# EAGLE design P6_V5 (EAGLE 8.2.2)
COMPANY: ADAFRUIT INDUSTRIES; DRAWN: KTOWN; REV: B
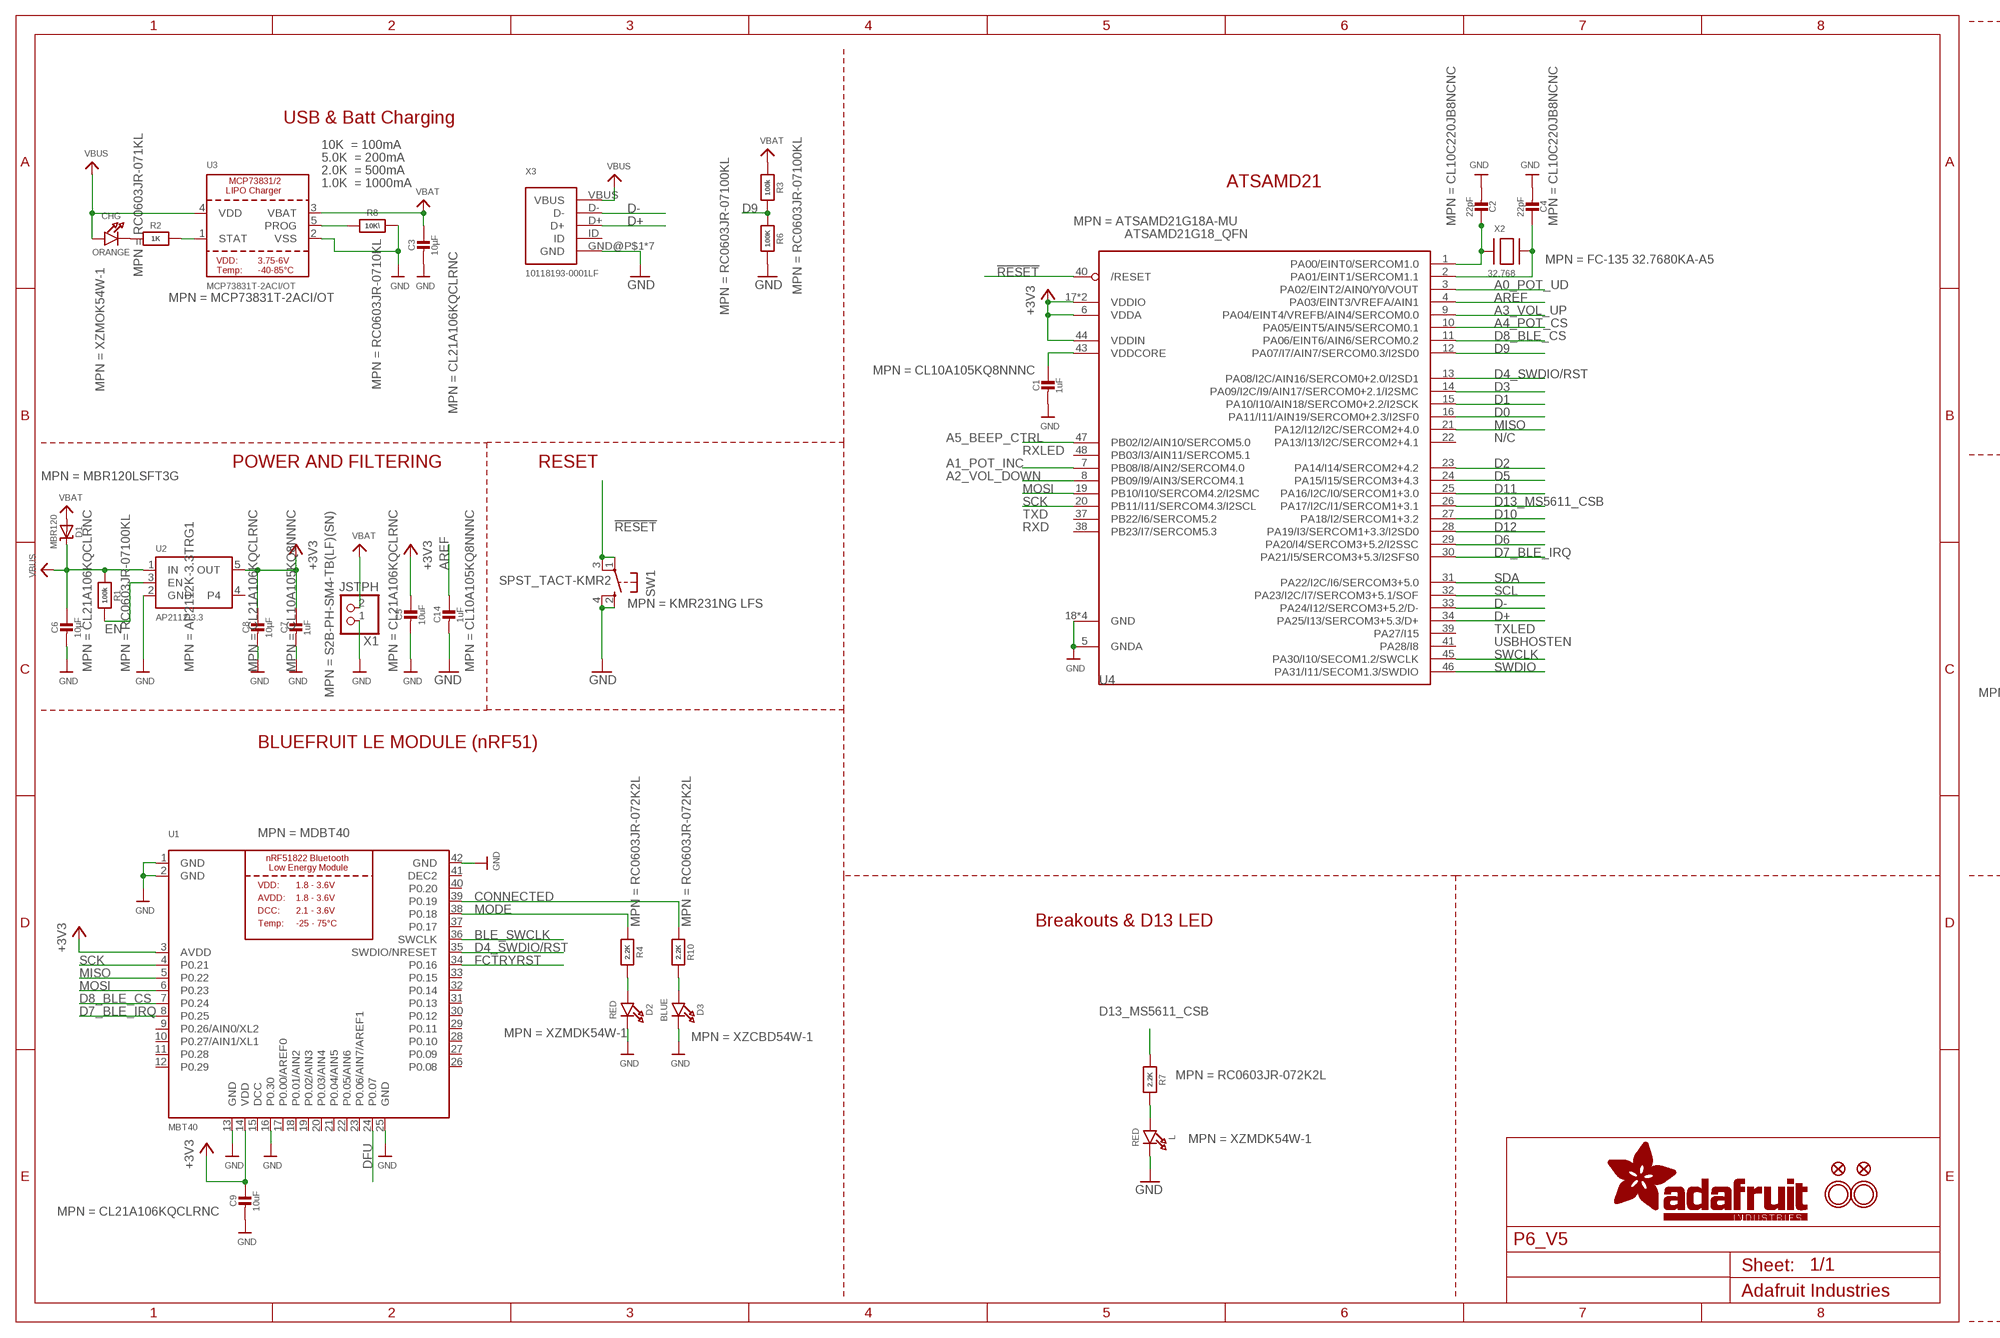
[diagram p0: schematic, sheet 1, part 1 of 2]
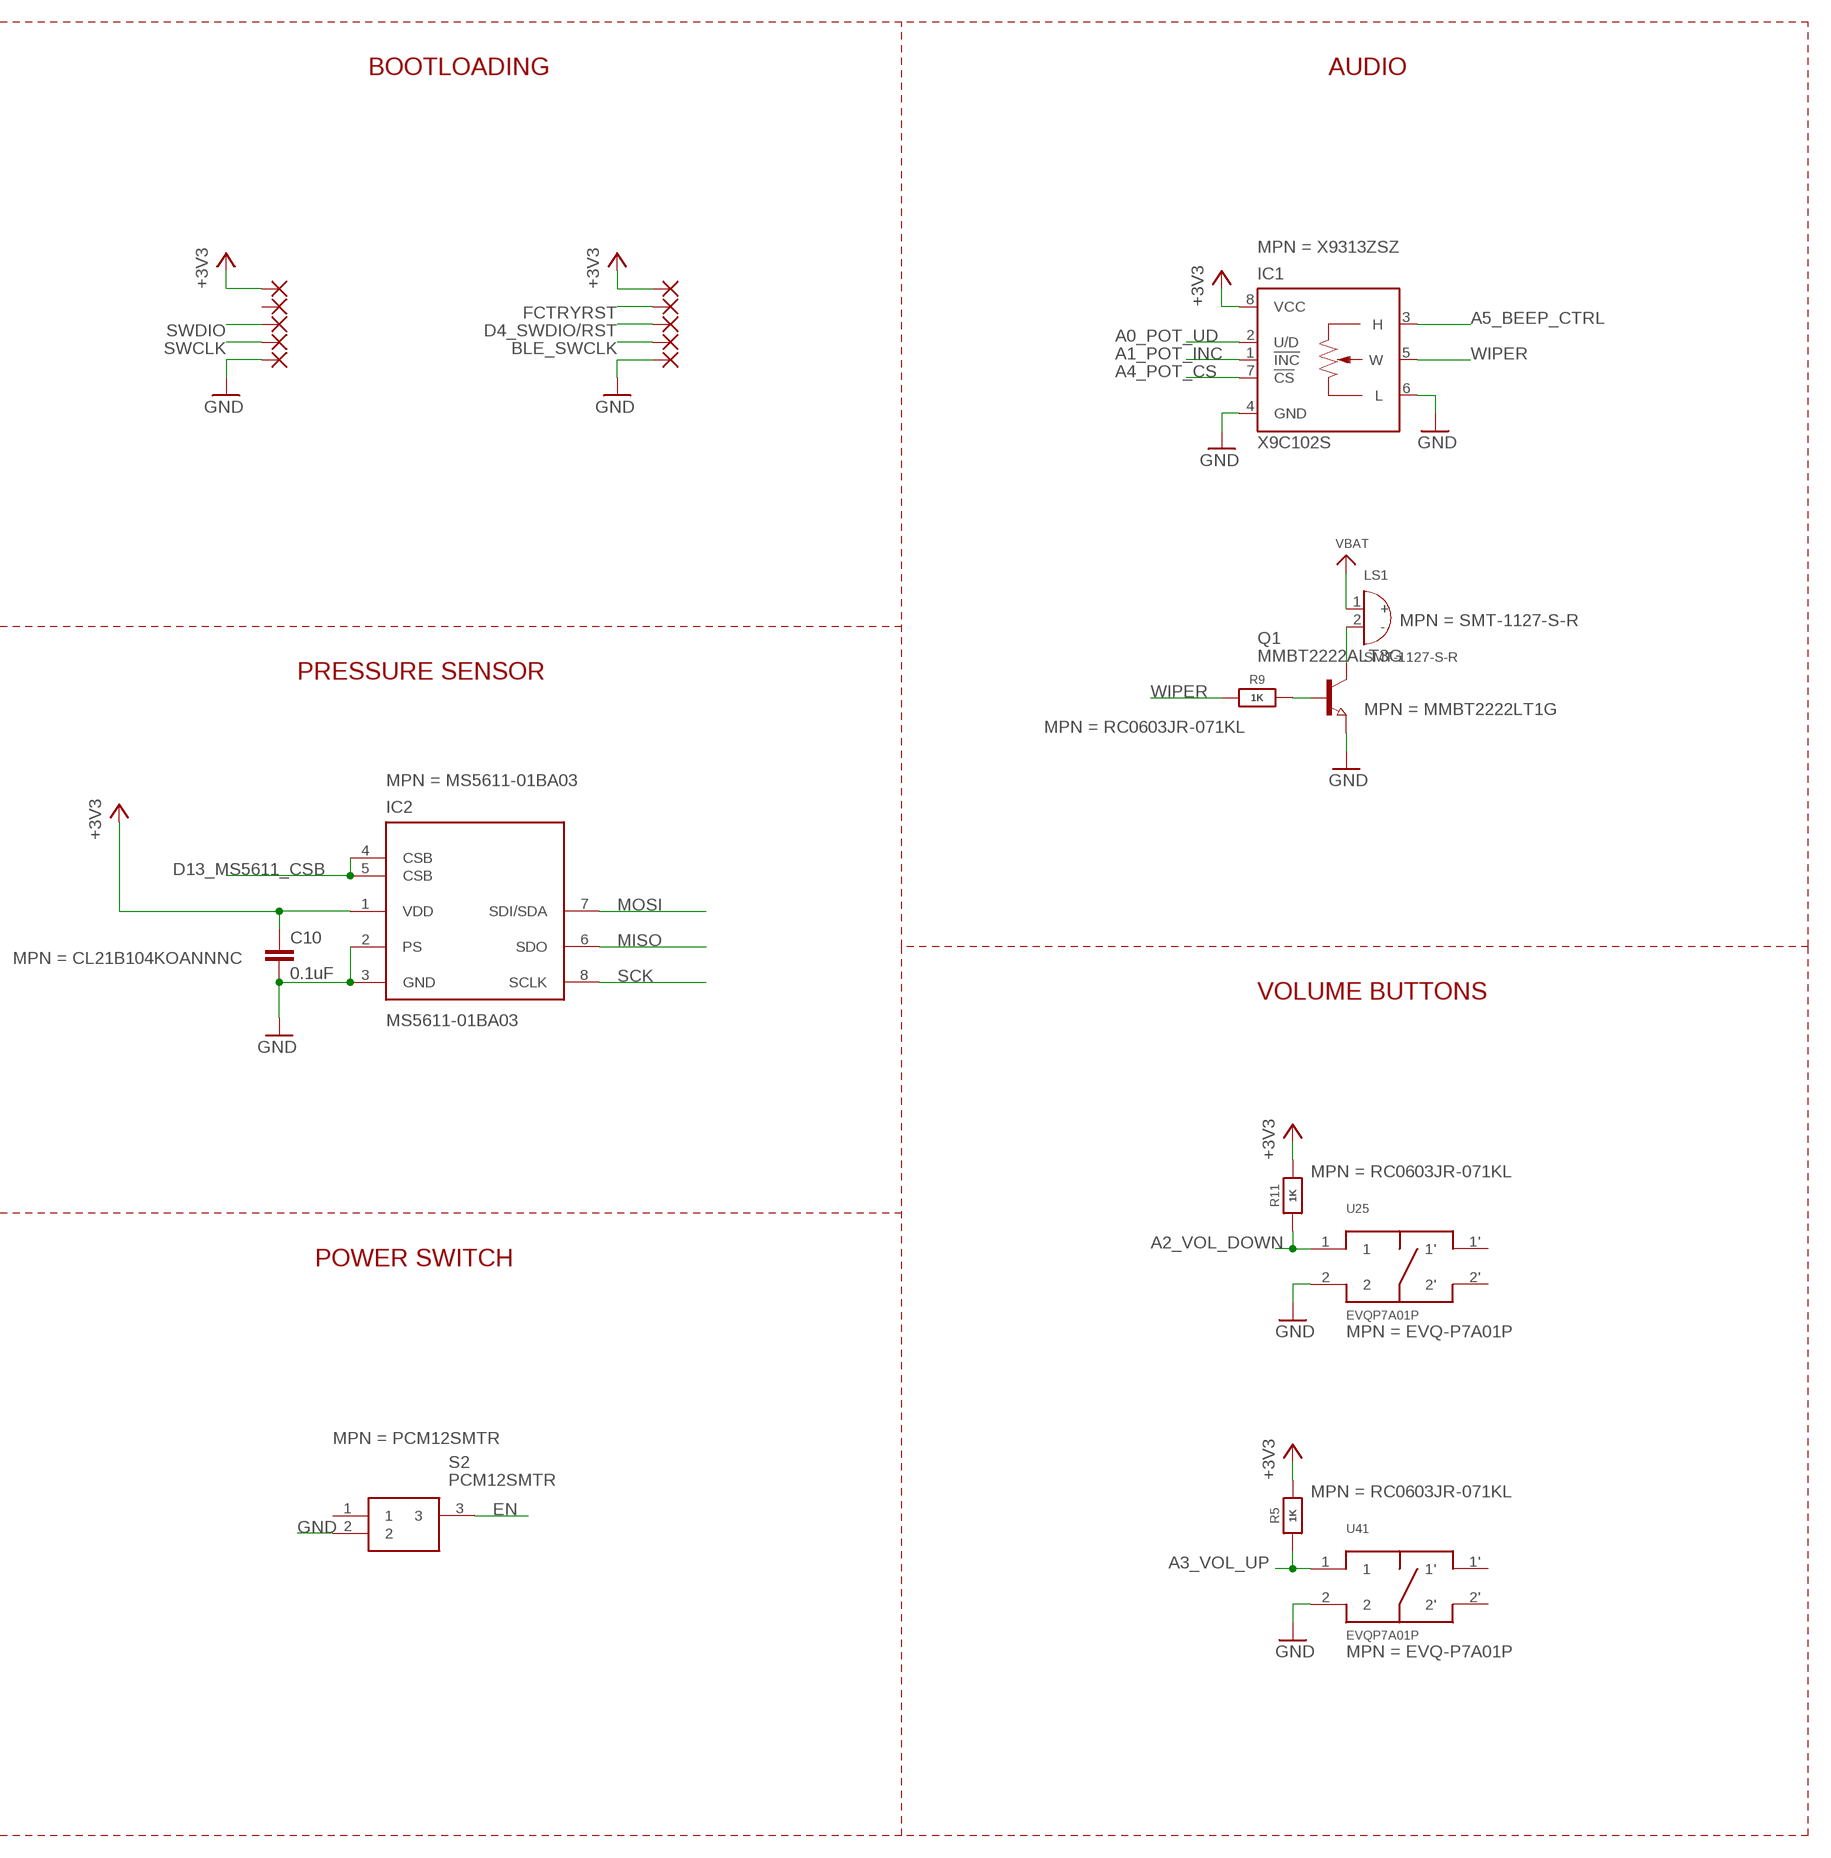
[diagram p1: schematic, sheet 1, part 2 of 2]

## Parts
C1  1uF  CAP_CERAMIC0603_NO  [0603-NO]
C2  22pF  CAP_CERAMIC0603_NO  [0603-NO]
C3  10µF  CAP_CERAMIC0805-NOOUTLINE  [0805-NO]
C4  22pF  CAP_CERAMIC0603_NO  [0603-NO]
C5  10uF  CAP_CERAMIC0805-NOOUTLINE  [0805-NO]
C6  10µF  CAP_CERAMIC0805-NOOUTLINE  [0805-NO]
C7  1uF  CAP_CERAMIC0603_NO  [0603-NO]
C8  10µF  CAP_CERAMIC0805-NOOUTLINE  [0805-NO]
C9  10uF  CAP_CERAMIC0805-NOOUTLINE  [0805-NO]
C10  0.1uF  C-EUC0805K  [C0805K]
C14  1uF  CAP_CERAMIC0603_NO  [0603-NO]
CHG  ORANGE  LED0805_NOOUTLINE  [CHIPLED_0805_NOOUTLINE]
D1  MBR120  DIODE-SCHOTTKYSOD-123  [SOD-123]
D2  RED  LED0805_NOOUTLINE  [CHIPLED_0805_NOOUTLINE]
D3  BLUE  LED0805_NOOUTLINE  [CHIPLED_0805_NOOUTLINE]
IC1  X9C102S  [SOIC08]
IC2  MS5611-01BA03  MS5611-01BA03UNO  [SON125P300X500X100-8N]
L  RED  LED0805_NOOUTLINE  [CHIPLED_0805_NOOUTLINE]
LS1  SMT-1127-S-R  [XDCR_SMT-1127-S-R]
PAD1  1,6/0,8  [1,6/0,8]
PAD2  1,6/0,8  [1,6/0,8]
PAD3  1,6/0,8  [1,6/0,8]
PAD4  1,6/0,8  [1,6/0,8]
PAD5  1,6/0,8  [1,6/0,8]
PAD6  1,6/0,8  [1,6/0,8]
PAD7  1,6/0,8  [1,6/0,8]
PAD8  1,6/0,8  [1,6/0,8]
PAD9  1,6/0,8  [1,6/0,8]
PAD10  1,6/0,8  [1,6/0,8]
Q1  MMBT2222ALT3G  NPN-TRANSISTOR_SOT23  [SOT23]
R1  100k  RESISTOR_0603_NOOUT  [0603-NO]
R2  1K  RESISTOR_0603_NOOUT  [0603-NO]
R3  100k  RESISTOR_0603_NOOUT  [0603-NO]
R4  2.2K  RESISTOR_0603_NOOUT  [0603-NO]
R5  1K  RESISTOR_0603_NOOUT  [0603-NO]
R6  100K  RESISTOR_0603_NOOUT  [0603-NO]
R7  2.2K  RESISTOR_0603_NOOUT  [0603-NO]
R8  10K\  RESISTOR_0603_NOOUT  [0603-NO]
R9  1K  RESISTOR_0603_NOOUT  [0603-NO]
R10  2.2K  RESISTOR_0603_NOOUT  [0603-NO]
R11  1K  RESISTOR_0603_NOOUT  [0603-NO]
S2  PCM12SMTR  [PCM12SMTR_1]
SW1  SPST_TACT-KMR2  [KMR2]
U1  MBT40  NRF51822_MODULE_MDBT40  [BLE_MODULE_RAYTAC_MDBT40]
U2  AP2112-3.3  VREG_SOT23-5  [SOT23-5]
U3  MCP73831T-2ACI/OT  MCP73831/2  [SOT23-5]
U4  ATSAMD21G18_QFN  ATSAMD21J_QFN  [TQFN48_7MM]
U25  EVQP7A01P  [EVQP7A01P]
U41  EVQP7A01P  [EVQP7A01P]
U$31  MOUNTINGHOLE2.5  [MOUNTINGHOLE_2.5_PLATED]
U$32  MOUNTINGHOLE2.5  [MOUNTINGHOLE_2.5_PLATED]
U$34  FIDUCIAL""  [FIDUCIAL_1MM]
U$35  FIDUCIAL""  [FIDUCIAL_1MM]
X1  JSTPH  CON_JST_PH_2PIN  [JSTPH2]
X2  32.768  XTAL-3.2X1.5  [XTAL3215]
X3  10118193-0001LF  [10118193-0001LF]

## Nets
!RESET: SW1.1(P) SW1.3(P1) U4.40(/RESET)
+3V3: C5.1 C7.1 C8.1 C9.1 C10.1 IC1.8(VCC) IC2.1(VDD) PAD2.1(P) PAD6.1(P) R5.2 R11.2 U1.3(AVDD) U1.14(VDD) U2.5(OUT) U4.6(VDDA) U4.17(VDDIO) U4.36(VDDIO) U4.44(VDDIN)
A0_POT_UD: IC1.2(U/D) U4.3(PA02/EINT2/AIN0/Y0/VOUT)
A1_POT_INC: IC1.1(!INC) U4.7(PB08/I8/AIN2/SERCOM4.0)
A2_VOL_DOWN: R11.1 U4.8(PB09/I9/AIN3/SERCOM4.1) U25.1
A3_VOL_UP: R5.1 U4.9(PA04/EINT4/VREFB/AIN4/SERCOM0.0) U41.1
A4_POT_CS: IC1.7(!CS) U4.10(PA05/EINT5/AIN5/SERCOM0.1)
A5_BEEP_CTRL: IC1.3(H) U4.47(PB02/I2/AIN10/SERCOM5.0)
AREF: C14.1 U4.4(PA03/EINT3/VREFA/AIN1)
BLE_SWCLK: PAD9.1(P) U1.36(SWCLK)
CONNECTED: R10.1 U1.39(P0.19)
D0: U4.16(PA11/I11/AIN19/SERCOM0+2.3/I2SF0)
D1: U4.15(PA10/I10/AIN18/SERCOM0+2.2/I2SCK)
D2: U4.23(PA14/I14/SERCOM2+4.2)
D3: U4.14(PA09/I2C/I9/AIN17/SERCOM0+2.1/I2SMC)
D4_SWDIO/RST: PAD8.1(P) U1.35(SWDIO/NRESET) U4.13(PA08/I2C/AIN16/SERCOM0+2.0/I2SD1)
D5: U4.24(PA15/I15/SERCOM3+4.3)
D6: U4.29(PA20/I4/SERCOM3+5.2/I2SSC)
D7_BLE_IRQ: U1.8(P0.25) U4.30(PA21/I5/SERCOM3+5.3/I2SFS0)
D8_BLE_CS: U1.7(P0.24) U4.11(PA06/EINT6/AIN6/SERCOM0.2)
D9: R3.2 R6.1 U4.12(PA07/I7/AIN7/SERCOM0.3/I2SD0)
D10: U4.27(PA18/I2/SERCOM1+3.2)
D11: U4.25(PA16/I2C/I0/SERCOM1+3.0)
D12: U4.28(PA19/I3/SERCOM1+3.3/I2SD0)
D13_MS5611_CSB: IC2.4(CSB) IC2.5(CSB) R7.1 U4.26(PA17/I2C/I1/SERCOM1+3.1)
D+: U4.34(PA25/I13/SERCOM3+5.3/D+) X3.D+
D-: U4.33(PA24/I12/SERCOM3+5.2/D-) X3.D-
DFU: U1.24(P0.07)
EN: R1.2 S2.3 U2.3(EN)
FCTRYRST: PAD7.1(P) U1.34(P0.16)
GND: C1.2 C2.2 C3.2 C4.2 C5.2 C6.2 C7.2 C8.2 C9.2 C10.2 C14.2 D2.C D3.C IC1.4(GND) IC1.6(L) IC2.2(PS) IC2.3(GND) L.C PAD5.1(P) PAD10.1(P) Q1.2(E) R6.2 R8.2 S2.2 SW1.2(S) SW1.4(S1) U1.1(GND) U1.2(GND) U1.13(GND) U1.16(P0.30) U1.25(GND) U1.42(GND) U2.2(GND) U3.2(VSS) U4.5(GNDA) U4.18(GND) U4.35(GND) U4.42(GND) U4.THERMAL(GND) U25.2 U41.2 X1.1 X3.GND@P$1(GND) X3.GND@P$2(GND) X3.GND@P$5(GND) X3.GND@P$6(GND) X3.GND@P$7(GND) X3.GND@P$8(GND) X3.GND@P$9(GND)
MISO: IC2.6(SDO) U1.5(P0.22) U4.21(PA12/I12/I2C/SERCOM2+4.0)
MODE: R4.1 U1.38(P0.18)
MOSI: IC2.7(SDI/SDA) U1.6(P0.23) U4.19(PB10/I10/SERCOM4.2/I2SMC)
N$1: CHG.C R2.1
N$2: L.A R7.2
N$3: R2.2 U3.1(STAT)
N$4: R8.1 U3.5(PROG)
N$5: C2.1 U4.1(PA00/EINT0/SERCOM1.0) X2.P$1
N$6: D2.A R4.2
N$7: C4.1 U4.2(PA01/EINT1/SERCOM1.1) X2.P$2
N$8: D3.A R10.2
N$9: Q1.1(B) R9.2
N$10: LS1.2(-) Q1.3(C)
SCK: IC2.8(SCLK) U1.4(P0.21) U4.20(PB11/I11/SERCOM4.3/I2SCL)
SCL: U4.32(PA23/I2C/I7/SERCOM3+5.1/SOF)
SDA: U4.31(PA22/I2C/I6/SERCOM3+5.0)
SWCLK: PAD4.1(P) U4.45(PA30/I10/SECOM1.2/SWCLK)
SWDIO: PAD3.1(P) U4.46(PA31/I11/SECOM1.3/SWDIO)
VBAT: C3.1 D1.A LS1.1(+) R3.1 U3.3(VBAT) X1.2
VBUS: C6.1 CHG.A D1.C R1.1 U2.1(IN) U3.4(VDD) X3.VBUS
VDDCORE: C1.1 U4.43(VDDCORE)
WIPER: IC1.5(W) R9.1
Unconnected: PAD1.1(P) S2.1 U1.9(P0.26/AIN0/XL2) U1.10(P0.27/AIN1/XL1) U1.11(P0.28) U1.12(P0.29) U1.17(P0.00/AREF0) U1.18(P0.01/AIN2) U1.19(P0.02/AIN3) U1.20(P0.03/AIN4) U1.21(P0.04/AIN5) U1.22(P0.05/AIN6) U1.23(P0.06/AIN7/AREF1) U1.26(P0.08) U1.27(P0.09) U1.28(P0.10) U1.29(P0.11) U1.30(P0.12) U1.31(P0.13) U1.32(P0.14) U1.33(P0.15) U1.37(P0.17) U1.40(P0.20) U2.4 U4.22(PA13/I13/I2C/SERCOM2+4.1) U4.37(PB22/I6/SERCOM5.2) U4.38(PB23/I7/SERCOM5.3) U4.39(PA27/I15) U4.41(PA28/I8) U4.48(PB03/I3/AIN11/SERCOM5.1) U25.1' U25.2' U41.1' U41.2' X3.ID

## Notes on the sheet
- BOOTLOADING | AUDIO
- USB & Batt Charging
- 10K  = 100mA
- 5.0K  = 200mA
- 2.0K  = 500mA
- 1.0K  = 1000mA | ATSAMD21
- N/C
- RXLED
- POWER AND FILTERING | RESET
- PRESSURE SENSOR
- TXD
- RXD
- TXLED
- USBHOSTEN
- VOLUME BUTTONS
- BLUEFRUIT LE MODULE (nRF51)
- POWER SWITCH
- Breakouts & D13 LED

## Power pins joined to a net without a drawn wire
DCC: U1.15(DCC)
DEC2: U1.41(DEC2)

## Library data of the parts
C1 C7 C14 = microbuilder:CAP_CERAMIC: Ceramic Capacitors For new designs, use the packages preceded by an '_' character since they are more reliable: The following footprints should be used on most boards: _0402 - Standard footprint for regular board layouts _0603 - Standard footprint for regular board layouts _0805 - Standard footprint for regular board layouts _1206 - Standard footprint for regular board layouts For extremely tight-pitch boards where space is at a premium, the following 'micro-pitch' footprints can be used (smaller pads, no silkscreen outline, etc.): _0402MP - Micro-pitch footprint for very dense/compact boards _0603MP - Micro-pitch footprint for very dense/compact boards _0805MP - Micro-pitch footprint for very dense/compact boards _1206MP - Micro-pitch footprint for very dense/compact boards; MPN: CL10A105KQ8NNNC
C2 C4 = microbuilder:CAP_CERAMIC: Ceramic Capacitors For new designs, use the packages preceded by an '_' character since they are more reliable: The following footprints should be used on most boards: _0402 - Standard footprint for regular board layouts _0603 - Standard footprint for regular board layouts _0805 - Standard footprint for regular board layouts _1206 - Standard footprint for regular board layouts For extremely tight-pitch boards where space is at a premium, the following 'micro-pitch' footprints can be used (smaller pads, no silkscreen outline, etc.): _0402MP - Micro-pitch footprint for very dense/compact boards _0603MP - Micro-pitch footprint for very dense/compact boards _0805MP - Micro-pitch footprint for very dense/compact boards _1206MP - Micro-pitch footprint for very dense/compact boards; MPN: CL10C220JB8NCNC
C3 C5 C6 C8 C9 = microbuilder:CAP_CERAMIC: Ceramic Capacitors For new designs, use the packages preceded by an '_' character since they are more reliable: The following footprints should be used on most boards: _0402 - Standard footprint for regular board layouts _0603 - Standard footprint for regular board layouts _0805 - Standard footprint for regular board layouts _1206 - Standard footprint for regular board layouts For extremely tight-pitch boards where space is at a premium, the following 'micro-pitch' footprints can be used (smaller pads, no silkscreen outline, etc.): _0402MP - Micro-pitch footprint for very dense/compact boards _0603MP - Micro-pitch footprint for very dense/compact boards _0805MP - Micro-pitch footprint for very dense/compact boards _1206MP - Micro-pitch footprint for very dense/compact boards; MPN: CL21A106KQCLRNC
C10 = rcl:C-EU: CAPACITOR, European symbol; MPN: CL21B104KOANNNC
CHG = microbuilder:LED: LED 0603 - 0603 Surface Mount Package 2mA: Green LED - Low Power (3.9mcd, 2ma, 1.7Vf) - Digikey: 475-2709-2-ND Orange LED - Low Power (9.8mcd, 2ma, 1.8Vf) - Digikey: 475-1194-2-ND Red LED - Low Power (5mcd, 2ma, 1.8Vf) - Digikey: 475-1195-2-ND Yellow LED - Low Power (7mcd, 2ma, 1.8Vf) - Digikey: 475-1196-2-ND 5mA: Blue LED - Low Power (17mcd, 5ma, 2.9Vf) - Digikey: LNJ937W8CRACT-ND 0805 - 0805 Surface Mount Package 2mA: Red LED (8.8mcd, 2mA, 1.8Vf, Clear) - Low Power [Digikey: 475-2510-1-ND] Green LED (5mcd, 2mA, 1.8Vf, Clear) - Low Power [Digikey: 475-2730-1-ND] Yellow LED (11.3mcd, 2mA, 1.8Vf, Clear) - Low Power [Digikey: 475-2555-1-ND] 20mA: Red LED (104mcd, 20mA, Diffused) - LS R976 [Digikey: 475-1278-6-ND] Red LED (12mcd, 20mA, 2.0Vf, Clear) - APT2012EC [Digikey: 754-1128-1-ND] Green LED (15mcd, 20mA, 2.2Vf, Clear) - APT2012GC [Digikey: 754-1131-1-ND] Orange LED (160mcd, 20mA, 2.1Vf, Clear) - APT2012SECK [Digikey: 754-1130-1-ND] 1206 - 1206 Surface Mount Package Green LED (26mcd, 20mA, Diffused) - LG N971 [Digikey: 475-1407-6-ND] Red LED (15mcd, 20mA, Diffused) - LH N974 [Digikey: 475-1416-6-ND] Cree - Cree High-Power Surface Mount LEDs XPEBWT-L1-0000-00D50 - White 111lm 350mA 2.9Vf 6200K 110° XTEAWT-00-0000-00000LEE3 - White 114lm 350mA 2.85Vf 5000K 115° Everlight - Everlight 45-21 Series Surface Mount LEDs 45-21/QK2C-B2832AC2CB2/2T - Warm White 2000mcd 20mA 3.25Vf 3050K 120° 45-21/LK2C-B38452C4CB2/2T - Nuetral White 2000mcd 20mA 3.25Vf 4150K 120° 45-21/LK2C-B50634C6CB2/2T - Cold White 2200mcd 20mA 3.25Vf 5650K 120° PLCC2 Reverse Mount LS T77K-J1L2-1-0-2-R18-Z - Red 11.25mcd 2mA 1.8Vf 630nm 120° LO T77K-L1M2-24-Z - Orange 19.6mcd 2mA 1.8Vf 606nm 120° LY T77K-K2M1-26-Z - Yellow 15.7mcd 2mA 1.8Vf 587nm 120°; MPN: XZMOK54W-1
D1 = microbuilder:DIODE-SCHOTTKY; MPN: MBR120LSFT3G
D2 L = microbuilder:LED: LED 0603 - 0603 Surface Mount Package 2mA: Green LED - Low Power (3.9mcd, 2ma, 1.7Vf) - Digikey: 475-2709-2-ND Orange LED - Low Power (9.8mcd, 2ma, 1.8Vf) - Digikey: 475-1194-2-ND Red LED - Low Power (5mcd, 2ma, 1.8Vf) - Digikey: 475-1195-2-ND Yellow LED - Low Power (7mcd, 2ma, 1.8Vf) - Digikey: 475-1196-2-ND 5mA: Blue LED - Low Power (17mcd, 5ma, 2.9Vf) - Digikey: LNJ937W8CRACT-ND 0805 - 0805 Surface Mount Package 2mA: Red LED (8.8mcd, 2mA, 1.8Vf, Clear) - Low Power [Digikey: 475-2510-1-ND] Green LED (5mcd, 2mA, 1.8Vf, Clear) - Low Power [Digikey: 475-2730-1-ND] Yellow LED (11.3mcd, 2mA, 1.8Vf, Clear) - Low Power [Digikey: 475-2555-1-ND] 20mA: Red LED (104mcd, 20mA, Diffused) - LS R976 [Digikey: 475-1278-6-ND] Red LED (12mcd, 20mA, 2.0Vf, Clear) - APT2012EC [Digikey: 754-1128-1-ND] Green LED (15mcd, 20mA, 2.2Vf, Clear) - APT2012GC [Digikey: 754-1131-1-ND] Orange LED (160mcd, 20mA, 2.1Vf, Clear) - APT2012SECK [Digikey: 754-1130-1-ND] 1206 - 1206 Surface Mount Package Green LED (26mcd, 20mA, Diffused) - LG N971 [Digikey: 475-1407-6-ND] Red LED (15mcd, 20mA, Diffused) - LH N974 [Digikey: 475-1416-6-ND] Cree - Cree High-Power Surface Mount LEDs XPEBWT-L1-0000-00D50 - White 111lm 350mA 2.9Vf 6200K 110° XTEAWT-00-0000-00000LEE3 - White 114lm 350mA 2.85Vf 5000K 115° Everlight - Everlight 45-21 Series Surface Mount LEDs 45-21/QK2C-B2832AC2CB2/2T - Warm White 2000mcd 20mA 3.25Vf 3050K 120° 45-21/LK2C-B38452C4CB2/2T - Nuetral White 2000mcd 20mA 3.25Vf 4150K 120° 45-21/LK2C-B50634C6CB2/2T - Cold White 2200mcd 20mA 3.25Vf 5650K 120° PLCC2 Reverse Mount LS T77K-J1L2-1-0-2-R18-Z - Red 11.25mcd 2mA 1.8Vf 630nm 120° LO T77K-L1M2-24-Z - Orange 19.6mcd 2mA 1.8Vf 606nm 120° LY T77K-K2M1-26-Z - Yellow 15.7mcd 2mA 1.8Vf 587nm 120°; MPN: XZMDK54W-1
D3 = microbuilder:LED: LED 0603 - 0603 Surface Mount Package 2mA: Green LED - Low Power (3.9mcd, 2ma, 1.7Vf) - Digikey: 475-2709-2-ND Orange LED - Low Power (9.8mcd, 2ma, 1.8Vf) - Digikey: 475-1194-2-ND Red LED - Low Power (5mcd, 2ma, 1.8Vf) - Digikey: 475-1195-2-ND Yellow LED - Low Power (7mcd, 2ma, 1.8Vf) - Digikey: 475-1196-2-ND 5mA: Blue LED - Low Power (17mcd, 5ma, 2.9Vf) - Digikey: LNJ937W8CRACT-ND 0805 - 0805 Surface Mount Package 2mA: Red LED (8.8mcd, 2mA, 1.8Vf, Clear) - Low Power [Digikey: 475-2510-1-ND] Green LED (5mcd, 2mA, 1.8Vf, Clear) - Low Power [Digikey: 475-2730-1-ND] Yellow LED (11.3mcd, 2mA, 1.8Vf, Clear) - Low Power [Digikey: 475-2555-1-ND] 20mA: Red LED (104mcd, 20mA, Diffused) - LS R976 [Digikey: 475-1278-6-ND] Red LED (12mcd, 20mA, 2.0Vf, Clear) - APT2012EC [Digikey: 754-1128-1-ND] Green LED (15mcd, 20mA, 2.2Vf, Clear) - APT2012GC [Digikey: 754-1131-1-ND] Orange LED (160mcd, 20mA, 2.1Vf, Clear) - APT2012SECK [Digikey: 754-1130-1-ND] 1206 - 1206 Surface Mount Package Green LED (26mcd, 20mA, Diffused) - LG N971 [Digikey: 475-1407-6-ND] Red LED (15mcd, 20mA, Diffused) - LH N974 [Digikey: 475-1416-6-ND] Cree - Cree High-Power Surface Mount LEDs XPEBWT-L1-0000-00D50 - White 111lm 350mA 2.9Vf 6200K 110° XTEAWT-00-0000-00000LEE3 - White 114lm 350mA 2.85Vf 5000K 115° Everlight - Everlight 45-21 Series Surface Mount LEDs 45-21/QK2C-B2832AC2CB2/2T - Warm White 2000mcd 20mA 3.25Vf 3050K 120° 45-21/LK2C-B38452C4CB2/2T - Nuetral White 2000mcd 20mA 3.25Vf 4150K 120° 45-21/LK2C-B50634C6CB2/2T - Cold White 2200mcd 20mA 3.25Vf 5650K 120° PLCC2 Reverse Mount LS T77K-J1L2-1-0-2-R18-Z - Red 11.25mcd 2mA 1.8Vf 630nm 120° LO T77K-L1M2-24-Z - Orange 19.6mcd 2mA 1.8Vf 606nm 120° LY T77K-K2M1-26-Z - Yellow 15.7mcd 2mA 1.8Vf 587nm 120°; MPN: XZCBD54W-1
IC1 = pot-xicor:X9C102*: Digital POTENTIOMETER; MF: INTERSIL; MPN: X9313ZSZ; OC_FARNELL: 1562072; OC_NEWARK: 79K8947
IC2 = Measurement-Specialties:MS5611-01BA03: Variometer Module, with stainless steel cap; MPN: MS5611-01BA03
LS1 = SMT-1127-S-R:SMT-1127-S-R: Audio Indicator Transducer Electromagnetic 3.6Vpk 100mA Solder Pad 2.5Vpk 2231Hz to 3231Hz Surface Mount; AVAILABILITY: Good; DESCRIPTION: Black Passive Electromagnetic SMD Buzzer 3V 80mA 2700Hz 92dB 9x3.2mm; MF: PUI Audio; MP: BOT-03D-BUJEON, SMT-1127-S-R; MPN: SMT-1127-S-R; PACKAGE: None; PRICE: 1.43 USD
PAD1-PAD10 = wirepad:1,6/0,8: THROUGH-HOLE PAD
Q1 = semicon-smd-ipc:NPN-TRANSISTOR_: NPN TRANSISTOR; MPN: MMBT2222LT1G
R1 R3 R6 = microbuilder:RESISTOR: Resistors For new designs, use the packages preceded by an '_' character since they are more reliable: The following footprints should be used on most boards: _0402 - Standard footprint for regular board layouts _0603 - Standard footprint for regular board layouts _0805 - Standard footprint for regular board layouts _1206 - Standard footprint for regular board layouts For extremely tight-pitch boards where space is at a premium, the following 'micro-pitch' footprints can be used (smaller pads, no silkscreen outline, etc.): _0402MP - Micro-pitch footprint for very dense/compact boards _0603MP - Micro-pitch footprint for very dense/compact boards _0805MP - Micro-pitch footprint for very dense/compact boards _1206MP - Micro-pitch footprint for very dense/compact boards; MPN: RC0603JR-07100KL
R2 R5 R9 R11 = microbuilder:RESISTOR: Resistors For new designs, use the packages preceded by an '_' character since they are more reliable: The following footprints should be used on most boards: _0402 - Standard footprint for regular board layouts _0603 - Standard footprint for regular board layouts _0805 - Standard footprint for regular board layouts _1206 - Standard footprint for regular board layouts For extremely tight-pitch boards where space is at a premium, the following 'micro-pitch' footprints can be used (smaller pads, no silkscreen outline, etc.): _0402MP - Micro-pitch footprint for very dense/compact boards _0603MP - Micro-pitch footprint for very dense/compact boards _0805MP - Micro-pitch footprint for very dense/compact boards _1206MP - Micro-pitch footprint for very dense/compact boards; MPN: RC0603JR-071KL
R4 R7 R10 = microbuilder:RESISTOR: Resistors For new designs, use the packages preceded by an '_' character since they are more reliable: The following footprints should be used on most boards: _0402 - Standard footprint for regular board layouts _0603 - Standard footprint for regular board layouts _0805 - Standard footprint for regular board layouts _1206 - Standard footprint for regular board layouts For extremely tight-pitch boards where space is at a premium, the following 'micro-pitch' footprints can be used (smaller pads, no silkscreen outline, etc.): _0402MP - Micro-pitch footprint for very dense/compact boards _0603MP - Micro-pitch footprint for very dense/compact boards _0805MP - Micro-pitch footprint for very dense/compact boards _1206MP - Micro-pitch footprint for very dense/compact boards; MPN: RC0603JR-072K2L
R8 = microbuilder:RESISTOR: Resistors For new designs, use the packages preceded by an '_' character since they are more reliable: The following footprints should be used on most boards: _0402 - Standard footprint for regular board layouts _0603 - Standard footprint for regular board layouts _0805 - Standard footprint for regular board layouts _1206 - Standard footprint for regular board layouts For extremely tight-pitch boards where space is at a premium, the following 'micro-pitch' footprints can be used (smaller pads, no silkscreen outline, etc.): _0402MP - Micro-pitch footprint for very dense/compact boards _0603MP - Micro-pitch footprint for very dense/compact boards _0805MP - Micro-pitch footprint for very dense/compact boards _1206MP - Micro-pitch footprint for very dense/compact boards; MPN: RC0603JR-0710KL
S2 = PCM12SMTR:PCM12SMTR: C & K COMPONENTS - PCM12SMTR - SWITCH, SPDT, 0.3A, 6VDC, SMD Source: Datasheet <http://www.farnell.com/datasheets/1789487.pdf>; ALLIED_NUMBER: 70417448; ALLIED_PRICE/STOCK: http://www.alliedelec.com/c-k-components-pcm12smtr/70417448/; DESCRIPTION: C & K COMPONENTS - PCM12SMTR - SWITCH, SPDT, 0.3A, 6VDC, SMD; HEIGHT: mm; MANUFACTURER_NAME: C & K COMPONENTS; MANUFACTURER_PART_NUMBER: PCM12SMTR; MPN: PCM12SMTR; RS_PART_NUMBER: 7931721P; RS_PRICE/STOCK: http://uk.rs-online.com/web/p/products/7931721P
SW1 = adafruit:SPST_TACT: SMT 6mm switch, EVQQ2 series http://www.ladyada.net/library/eagle; MPN: KMR231NG LFS
U1 = microbuilder:NRF51822_MODULE_MDBT40: nRF51822 Bluetooth Low Energy Module; MPN: MDBT40
U2 = microbuilder:VREG_SOT23-5: SOT23-5 Fixed Voltage Regulators Part Current Out V Out V In V Dropout θJA (°C/W) TJ (°C) Digikey Part No. ADP121 150mA 3.3V 3.4-5.5V 0.09V @ 150mA -- -- ADP121-AUJZ33R7CT-ND ADP121 150mA 3.0V 3.1-5.5V 0.09V @ 150mA -- -- ADP121-AUJZ30R7CT-ND ADP122 300mA 3.3V 3.4-5.5V 0.085V @ 300mA -- -- ADP122AUJZ-3.3-R7CT-ND ADP1712 300mA 3.3V 3.5-5.5V 0.17V @ 300mA -- -- ADP1712AUJZ-3.3-R7TR-ND AP7311 (Low Cost) 150mA 3.3V 3.5-6V 0.15V @ 150mA -- -- AP7311-33WG-7DICT-ND LD39015M18R 150mA 1.8V 1.9V-5.5V 0.08V @ 100mA -- -- 497-6977-1-ND LP2985A-33DBVR 150mA 3.3V 3.3-16V 0.28V @ 150mA 206 150 296-18479-1-ND MCP1824T-3302E/OT 300mA 3.3V 3.5V-6V 0.2V @ 300mA -- -- MCP1824T-3302E/OTCT-ND MIC5205-2.5YM5 TR 150mA 2.5V 2.7-16V 0.165V @ 150mA -- -- 576-1257-2-ND MIC5205-3.0YM5 TR 150mA 3.0V 3.2V-16V 0.165V @ 150mA -- -- 576-1258-2-ND MIC5205-3.3YM5 TR 150mA 3.3V 3.5V-16V 0.165V @ 150mA -- -- 576-1259-2-ND TPS780330220 150mA 3.3V+2.2V 3.6-5.5V 250mV Max -- -- 296-23332-1-ND TDA3663/N1,135 100mA 3.3V 3.5-45V 0.18V @ 50mA -- -- 568-5343-1-ND Max operating temp can be calculated using θJA, TJ (max junction temperature), and power in watts. Set the "Maximum Ambient Temperature" until it reaches TJ ("Max Junction Temperature"), which is the absolute limit for safe use of the regulator: Heat Sink Temperature Calculator <http://www.daycounter.com/Calculators/Heat-Sink-Temperature-Calculator.phtml> For example, With 12V source into a 3.3V LP2985 and a 30mA load, we are dissipating (12V-3.3V) * 0.03A = 0.261W. With a θJA of 206 °C/W, a TJ of 150°C, and 261mW we can safely use the chip without a heat sink up to 75°C (=147.1°C Junction Temperature).; MPN: AP2112K-3.3TRG1
U3 = microbuilder:MCP73831/2: MCP73831/2 LIPO Charger VDD: 3.75 - 6V Temp -40 - 85°C Programmable Charge Rate: 15-500mA NOTE: STAT is a tri-state logic output on the MCP73831 and an open-drain output on the MCP73832. SOT23-5 with 4.2V output and tri-state logic on STAT = MCP73831T-2ACI/OT; MPN: MCP73831T-2ACI/OT
U4 = microbuilder:ATSAMD21J; MPN: ATSAMD21G18A-MU
U25 U41 = EVQP7A01P:EVQP7A01P: EVQP7A01P Tactile Switch Surface Mount Right Angle; MPN: EVQ-P7A01P
U$31 U$32 = microbuilder:MOUNTINGHOLE: Mounting Hole For #2 screws (0.086"/2.18mm width, 0.094"/2.4mm hole) use 2.5mm; BOM: EXCLUDE
U$34 U$35 = microbuilder:FIDUCIAL: Fiducial Alignment Points Various fiducial points for machine vision alignment.; BOM: EXCLUDE
X1 = microbuilder:CON_JST_PH_2PIN: JST 2-Pin Right-Angle Connector PH-Series - 4UConnector: 17311 SH-Series - 4UConnector: 07278; MPN: S2B-PH-SM4-TB(LF)(SN)
X2 = adafruit2:XTAL: Low cost SMT crystals, no capacitors included http://www.ladyada.net/library/eagle; MPN: FC-135 32.7680KA-A5
X3 = 10118193-0001LF:10118193-0001LF

## Board
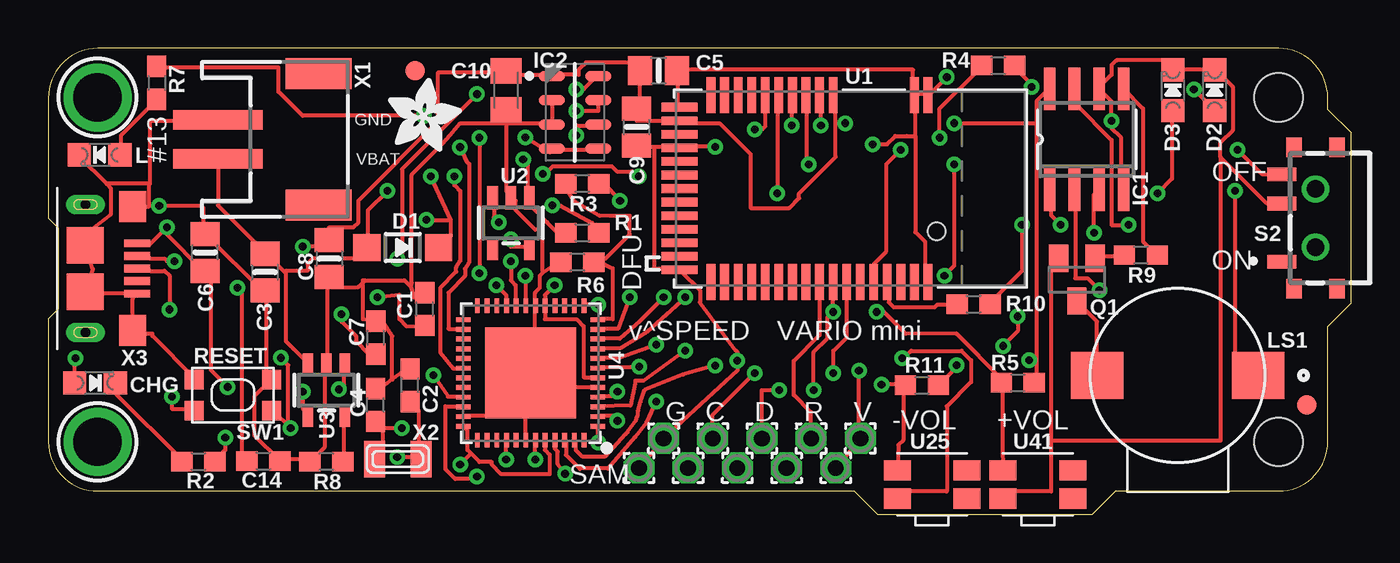
[diagram p2: board, top side]
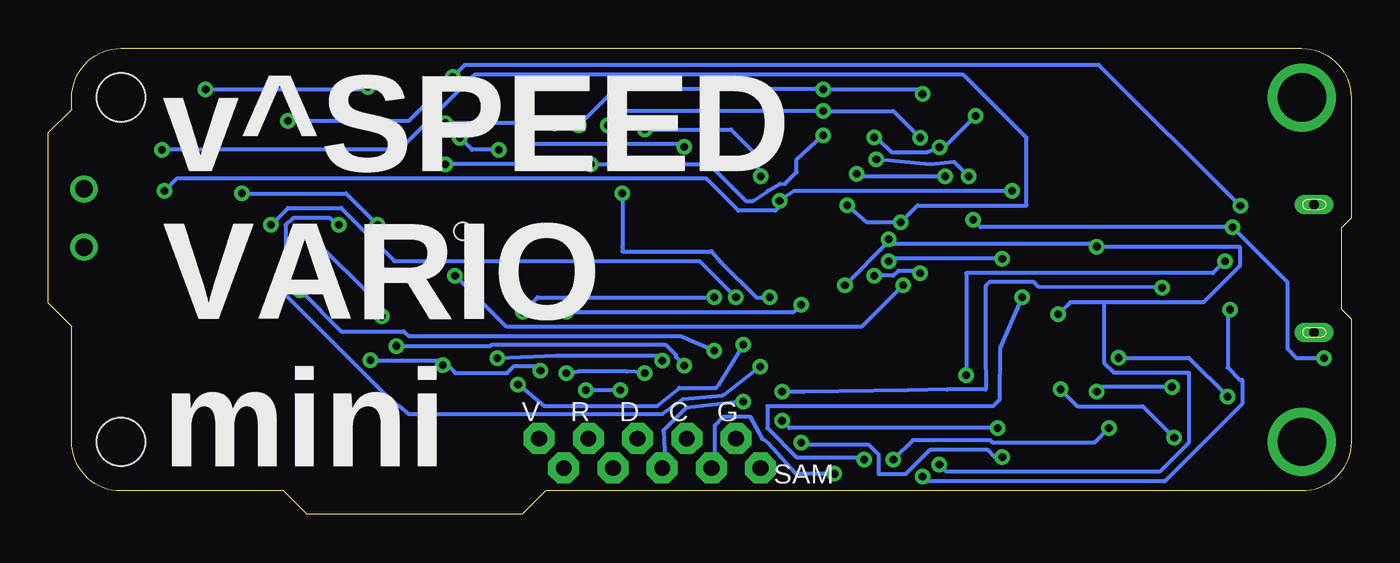
[diagram p3: board, bottom side, seen from below]

Size 67.24 x 24.06 mm. Coordinates in mm from the lower left corner, seen from the top.
Outline: 63.5,1.2 arc90 66.04,3.74 66.04,9.7 67.24,10.9 67.24,19.7 66.04,20.9 66.04,21.52 arc90 63.5,24.06 2.54,24.06 arc90 0,21.52 0,15.3 0.51,14.79 0.51,10.6 0,10.09 0,3.74 arc90 2.54,1.2 41.59,1.2 42.79,0 53.9,0 55.1,1.2 63.5,1.2
Copper layers (1*16): Top 0.035mm / dielectric 1.5mm / Bottom 0.035mm
Design rules "adafruit *": minimum track width 8mil, minimum drill 15.5mil, track to track 8mil, track to pad 8mil, pad to pad 8mil, via to via 8mil, smd to smd 8mil, copper to edge 10mil, drill to drill 8mil, minimum pad ring 10mil, minimum via ring 8mil, stop-mask expansion 2mil, vias tented up to drill 20mil, thermal gap 10mil
Holes 2.5 mm at 63.5,3.74 63.5,21.52

### Footprints (pad centres in the part's own frame; a part is rotated, then mirrored left to right if it is on the bottom)
0603-NO = smd 1.1 x 1: 1 -0.85,0; 2 0.85,0
0805-NO = smd 1.24 x 1.5: 1 -0.95,0; 2 0.95,0
C0805K = smd 1.3 x 1.6: 1 -1,0; 2 1,0
CHIPLED_0805_NOOUTLINE = smd 1.2 x 1.2: A 0,-1.05; C 0,1.05
SOD-123 = smd 1.4 x 1.4: A 1.85,0; C -1.85,0
SOIC08 = smd 0.6 x 2.2: 1 -1.905,-2.6; 2 -0.635,-2.6; 3 0.635,-2.6; 4 1.905,-2.6; 5 1.905,2.6; 6 0.635,2.6; 7 -0.635,2.6; 8 -1.905,2.6
SON125P300X500X100-8N = smd 1.35 x 0.55: 1 -1.2,1.875; 2 -1.2,0.625; 3 -1.2,-0.625; 4 -1.2,-1.875; 5 1.2,-1.875; 6 1.2,-0.625; 7 1.2,0.625; 8 1.2,1.875
XDCR_SMT-1127-S-R = smd 2.71 x 2.41: 1 -4.15,0; 2 4.15,0
1,6/0,8 = drill 0.813 pad 1.6 octagon: 1 0,0
SOT23 = smd 1 x 1.4: 1 -0.95,-1.1; 2 0.95,-1.1; 3 0,1.1
PCM12SMTR_1 = smd 0.7 x 1.5: 1 -2.25,1.75; 2 0.75,1.75; 3 2.25,1.75 | smd 1 x 0.8: 4 -3.65,1.1; 5 -3.65,-1.1; 6 3.65,1.1; 7 3.65,-1.1 | drill 0.9 pad 1.4: 8 -1.5,0; 9 1.5,0
KMR2 = smd 1 x 1: 1 2,0.8; 2 2,-0.8; 3 -2,0.8; 4 -2,-0.8
BLE_MODULE_RAYTAC_MDBT40 = smd 1.85 x 0.45: 1 -4.825,4; 2 -4.825,3.3; 3 -4.825,-0.9; 4 -4.825,-1.6; 5 -4.825,-2.3; 6 -4.825,-3; 7 -4.825,-3.7; 8 -4.825,-4.4; 9 -4.825,-5.1; 10 -4.825,-5.8; 11 -4.825,-6.5; 12 -4.825,-7.2; 26 4.825,-7.2; 27 4.825,-6.5; 28 4.825,-5.8; 29 4.825,-5.1; 30 4.825,-4.4; 31 4.825,-3.7; 32 4.825,-3; 33 4.825,-2.3; 34 4.825,-1.6; 35 4.825,-0.9; 36 4.825,-0.2; 37 4.825,0.5; 38 4.825,1.2; 39 4.825,1.9; 40 4.825,2.6; 41 4.825,3.3; 42 4.825,4 | smd 0.45 x 1.85: 13 -4.2,-8.825; 14 -3.5,-8.825; 15 -2.8,-8.825; 16 -2.1,-8.825; 17 -1.4,-8.825; 18 -0.7,-8.825; 19 0,-8.825; 20 0.7,-8.825; 21 1.4,-8.825; 22 2.1,-8.825; 23 2.8,-8.825; 24 3.5,-8.825; 25 4.2,-8.825 | hole 0.9: 2.2,4.45
SOT23-5 = smd 0.55 x 1.2: 1 -0.95,-1.3; 2 0,-1.3; 3 0.95,-1.3; 4 0.95,1.3; 5 -0.95,1.3
TQFN48_7MM = smd 0.25 x 0.75: 1 -2.75,-3.475; 2 -2.25,-3.475; 3 -1.75,-3.475; 4 -1.25,-3.475; 5 -0.75,-3.475; 6 -0.25,-3.475; 7 0.25,-3.475; 8 0.75,-3.475; 9 1.25,-3.475; 10 1.75,-3.475; 11 2.25,-3.475; 12 2.75,-3.475; 25 2.75,3.475; 26 2.25,3.475; 27 1.75,3.475; 28 1.25,3.475; 29 0.75,3.475; 30 0.25,3.475; 31 -0.25,3.475; 32 -0.75,3.475; 33 -1.25,3.475; 34 -1.75,3.475; 35 -2.25,3.475; 36 -2.75,3.475 | smd 0.75 x 0.25: 13 3.475,-2.75; 14 3.475,-2.25; 15 3.475,-1.75; 16 3.475,-1.25; 17 3.475,-0.75; 18 3.475,-0.25; 19 3.475,0.25; 20 3.475,0.75; 21 3.475,1.25; 22 3.475,1.75; 23 3.475,2.25; 24 3.475,2.75; 37 -3.475,2.75; 38 -3.475,2.25; 39 -3.475,1.75; 40 -3.475,1.25; 41 -3.475,0.75; 42 -3.475,0.25; 43 -3.475,-0.25; 44 -3.475,-0.75; 45 -3.475,-1.25; 46 -3.475,-1.75; 47 -3.475,-2.25; 48 -3.475,-2.75 | smd 4.7 x 4.7: THERMAL 0,0
EVQP7A01P = smd 1.4 x 1.05: 1 0,1.45; 1' 3.6,1.45; 2 0,0; 2' 3.6,0
MOUNTINGHOLE_2.5_PLATED = drill 2.5 pad 3.2: P$1 0,0
FIDUCIAL_1MM = smd 1 x 1: 1 0,0
JSTPH2 = smd 1 x 4.6: 1 -1,-3.7; 2 1,-3.7 | smd 1.6 x 3.4: NC1 -3.4,1.5; NC2 3.4,1.5
XTAL3215 = smd 1.1 x 1.9: P$1 1.2,0; P$2 -1.2,0
10118193-0001LF = smd 0.4 x 1.35: D+ 0,2.675; D- -0.65,2.675; GND@P$5 1.3,2.675; ID 0.65,2.675; VBUS -1.3,2.675 | drill 0.5 pad 0.9 long: GND@P$1 -3.3,0; GND@P$2 3.3,0 | smd 1.6 x 1.4: GND@P$6 3.2,2.45; GND@P$7 -3.2,2.45 | smd 1.9 x 1.9: GND@P$8 1.2,0; GND@P$9 -1.2,0

### Placement (x,y rotation side)
C1  19.43,10.6 90 top
C2  18.67,6.66 90 top
C3  11.18,12.5 270 top
C4  16.89,5.65 90 top
C5  31.5,22.92 0 top
C6  8.09,13.52 90 top
C7  16.91,9.12 90 top
C8  14.49,13.21 270 top
C9  30.35,20 270 top
C10  23.62,21.9 270 top
C14  11.1,2.75 0 top
CHG  2.41,6.79 270 top
D1  18.29,13.77 180 top
D2  60.2,21.9 0 top
D3  58.04,21.9 0 top
IC1  53.59,19.36 0 top
IC2  27.18,20.76 0 top
L  2.64,18.56 90 top
LS1  58.29,7.17 180 top
PAD1  38.1,2.39 0 top
PAD2  40.64,2.39 0 top
PAD3  35.56,2.39 0 top
PAD4  33.02,2.39 0 top
PAD5  30.48,2.39 0 top
PAD6  41.91,3.91 0 top
PAD7  39.37,3.91 0 top
PAD8  36.83,3.91 0 top
PAD9  34.29,3.91 0 top
PAD10  31.75,3.91 0 top
Q1  53.09,12.12 180 top
R1  27.56,14.54 0 top
R2  7.75,2.72 0 top
R3  27.56,17.07 180 top
R4  49.02,23.17 0 top
R5  50.04,6.79 0 top
R6  27.3,13.01 180 top
R7  5.59,22.28 270 top
R8  14.35,2.72 180 top
R9  56.39,13.39 180 top
R10  47.75,10.85 0 top
R11  45.09,6.66 0 top
S2  65.4,15.3 90 top
SW1  9.52,6.15 180 top
U1  41.4,16.82 270 top
U2  23.88,15.04 180 top
U3  14.35,6.41 180 top
U4  24.89,7.3 90 top
U25  43.81,0.82 0 top
U41  49.28,0.82 0 top
U$7  [ADAFRUIT_3.5MM]  17.53,18.73 0 top
U$31  2.54,21.52 270 top
U$32  2.54,3.74 270 top
U$34  18.92,22.92 270 top
U$35  64.94,5.65 270 top
X1  12.45,19.36 270 top
X2  18.03,2.85 0 top
X3  1.91,12.69 270 top

### Tracks (layer width: path | path; a pad name or v marks a point on that pad's centre or on a via)
!RESET  (via drill 0.39)
  Top 0.203: v23.62,2.83 23.62,3.7 U4.40 | SW1.3 11.62,5.33 v12.5,4.45 12.38,4.7 12.38,7.7 v12,8.07 | v6.37,6.08 6.37,5.45 7.5,5.45 SW1.1
  Bottom 0.203: v23.62,2.83 22.62,3.83 18.62,3.83 18.5,3.7 13.25,3.7 v12.5,4.45 | v6.37,6.08 8.38,8.07 v12,8.07
+3V3  (via drill 0.39)
  Top 0.203: 45.88,6.7 R11.2 46,6.7 46.88,7.57 v46.88,7.7 | 51,20.2 51,21.32 51.62,21.95 IC1.8 | 51,20.2 51,7.95 | 51,7.95 51,6.82 R5.2 | 51,7.95 v50.62,7.95 | 40.62,20.2 40.62,18.45 38.75,16.57 38.75,16.32 38.25,15.82 36.25,15.82 36.25,18.59 34.64,20.2 32.62,20.2 U1.14 32.5,20.32 30.38,20.32 30.38,20.82 C9.1 30.38,20.95 30.5,21.07 30.5,22.82 C5.1 30.5,22.95 30.5,23.32 27.75,23.32 27.38,22.95 27.38,22.7 26,22.7 IC2.1 25.88,22.7 23.62,22.7 23.62,22.82 C10.1 23.5,22.82 20.12,22.82 20.12,20.32 16,16.2 16,15.07 15.75,14.82 14.5,14.82 14.5,14.2 C8.1 14.38,14.07 14.38,13.82 v13.12,13.82 | 40.62,20.2 40.62,21.57 U1.3 | U4.6 28.25,7.07 27.62,7.07 27.62,9.7 27.25,10.07 25.62,10.07 25.62,10.7 U4.17 25.62,10.82 25.62,11.32 v26.12,11.82 | 21.81,3.14 22.25,2.7 22.88,2.7 22.88,2.58 23.38,2.08 25.88,2.08 25.88,3.08 25.62,3.33 25.62,3.7 U4.44 | 21.81,3.14 21.62,3.33 21.62,4.33 21.5,4.45 U4.36 | v15.12,10.32 15.12,9.95 15.88,9.2 15.88,8.95 16.51,8.31 17.12,8.32 C7.1 | v23.88,14.2 23.88,13.82 24.75,13.82 U2.5 | v21.25,2.58 21.81,3.14 | v46.75,20.2 51,20.2 | 40.62,20.2 v41.12,20.2 | v41.84,7.41 41.84,4.54 41.91,4.47 PAD6.1 40.64,2.34 PAD2.1
  Bottom 0.203: v50.62,7.95 47.12,7.95 v46.88,7.7 46.84,7.66 46.61,7.68 46.23,7.3 43.56,7.3 43.2,7.66 41.84,7.66 v41.84,7.41 | v15.12,10.32 14.5,10.95 12.75,10.95 | 12.75,10.95 7.62,10.95 5.75,12.82 5.75,13.82 v13.12,13.82 13.25,13.95 23.62,13.95 v23.88,14.2 23.88,14.07 v26.12,11.82 | v21.25,2.58 20.88,2.2 9.88,2.2 8.38,3.7 8.38,7.32 12.25,7.32 12.75,7.82 12.75,10.95 | v41.12,20.2 v46.75,20.2
A0_POT_UD  (via drill 0.39)
  Top 0.203: v32.88,8.45 30.72,6.89 30.3,6.89 30.05,5.62 28.38,5.58 U4.3 | v54.25,11.57 53.62,12.2 53,12.2 53,16.7 IC1.2
  Bottom 0.203: v32.88,8.45 34.62,9.2 48.64,9.2 48.89,9.45 52.13,9.45 v54.25,11.57
A1_POT_INC  (via drill 0.39)
  Top 0.203: v30.5,7.62 30.5,7.57 28.38,7.57 U4.7 | v52.25,14.95 51.75,15.45 51.75,16.7 IC1.1
  Bottom 0.203: v30.5,7.62 32.43,6.15 34.49,5.95 35.56,5.18 48.64,5.18 49.15,5.59 49.62,5.95 55,11.32 55,14.95 54.61,15.3 52.7,15.3 52.36,14.95 v52.25,14.95
A2_VOL_DOWN  (via drill 0.39)
  Top 0.203: v31.38,8.75 29.48,8.07 28.38,8.07 U4.8 | v43,6.7 44.12,6.7 R11.1 44.12,6.58 44.12,3.83 43.88,3.58 U25.1
  Bottom 0.203: v31.38,8.75 32.62,6.7 32.77,6.53 34.67,6.53 35.81,5.59 41.66,5.59 42.97,6.7 v43,6.7
A3_VOL_UP  (via drill 0.39)
  Top 0.203: v32.88,11.2 30.9,9.43 29.5,8.57 28.38,8.57 U4.9 | v42.75,10.45 43.12,10.45 44.25,9.32 46.86,9.33 49.25,6.94 49.12,6.82 R5.1 49.25,6.7 49.25,3.58 U41.1
  Bottom 0.203: v32.88,11.2 42,11.2 v42.75,10.45
A4_POT_CS  (via drill 0.39)
  Top 0.203: v31.75,11.2 30.5,9.95 29.5,9.07 28.38,9.07 U4.10 | v55.75,14.95 54.88,14.95 54.88,19.32 53,21.2 53,21.95 IC1.7
  Bottom 0.203: v31.75,11.2 33.62,13.07 49.38,13.07 52.13,15.83 54.87,15.83 v55.75,14.95
A5_BEEP_CTRL  (via drill 0.39)
  Top 0.203: U4.47 27.21,3.75 27.21,3.32 27.54,3 28.75,3 29.8,4.15 29.91,4.25 30.33,4.84 30.39,5.04 30.43,5.14 30.44,5.35 30.56,5.81 30.78,6.42 32.76,7.22 v34.42,7.68 | v53.98,14.54 53.98,16.51 IC1.3 | v50.04,10.22 50.04,9.46 v49.28,8.69
  Bottom 0.203: v53.98,14.54 53.85,14.54 50.04,10.72 v50.04,10.22 | v34.42,7.68 34.86,8.12 34.86,8.22 35.4,8.76 44.36,8.76 44.43,8.69 v49.28,8.69
AREF  (via drill 0.39)
  Top 0.203: v29.38,6.33 29.38,6.08 28.38,6.08 U4.4 | v9.75,11.7 10,11.45 10,2.95 10.12,2.83 C14.1
  Bottom 0.203: v29.38,6.33 28.25,6.31 22.86,6.41 20.86,6.44 18.86,6.44 18.88,8.45 18.88,11.79 18.67,12 16.38,12 16.13,11.74 v9.75,11.7
BLE_SWCLK  (via drill 0.39)
  Top 0.203: U1.36 41.2,10.76 41.22,10.74 41.22,9.14 40.51,8.44 v40.51,7.3 | PAD9.1 34.29,5.14 v36.45,7.3
  Bottom 0.203: v40.51,7.3 40.37,7.3 39.92,7.37 37.39,7.37 36.45,7.31 v36.45,7.3
CONNECTED
  Top 0.203: R10.1 46.88,10.82 45.88,10.82 45.75,10.7 43.63,10.7 43.5,10.82 43.38,10.95 43.38,11.95 U1.39
D4_SWDIO/RST  (via drill 0.39)
  Top 0.203: v28.38,10.82 27.75,10.82 U4.13 | U1.35 40.5,11.95 40.5,11.07 v40.51,10.45 40.21,10.15 40.21,9.08 39.5,8.37 v39.5,6.41 | v37.72,6.41 36.83,6.41 36.84,4.54 36.83,4.53 PAD8.1
  Bottom 0.203: v28.38,10.82 28.75,10.45 v40.51,10.45 | v37.72,6.41 v39.5,6.41
D7_BLE_IRQ  (via drill 0.39)
  Top 0.203: U4.30 21.45,7.52 20.93,7.52 20.24,8.32 20.24,11.72 21.05,12.53 21.05,12.77 21.26,13.1 21.26,16.69 20.96,17 v20.96,17.46 | U1.8 37,20.04 36.83,19.87 v36.45,19.87 | v25.53,17.58 25.64,17.58 26.04,17.98 29.07,17.98 29.35,17.71 30.1,17.71 30.35,17.46 v30.48,17.46
  Bottom 0.203: v36.45,19.87 32,19.87 30.59,18.46 30.59,18.11 30.61,17.84 30.48,17.71 v30.48,17.46 | v20.96,17.46 25.4,17.46 v25.53,17.58
D8_BLE_CS  (via drill 0.39)
  Top 0.203: v30,11.2 29.4,9.57 28.38,9.57 U4.11 | v37.62,16.57 37.62,16.95 37.62,21.57 U1.7
  Bottom 0.203: v30,11.2 30.7,11.2 32.51,13.01 33.01,13.57 37.62,13.57 37.61,13.82 v37.61,16.57 v37.62,16.57
D9
  Top 0.203: U4.12 28.38,10.07 29.12,10.07 29.12,12.7 28.38,13.07 R6.1 28.75,13.2 30,14.45 30,15.41 28.97,15.41 28.45,15.42 27.12,16.17 26.38,17.32 R3.2
D13_MS5611_CSB  (via drill 0.39)
  Top 0.203: v21.25,18.96 21.59,18.22 21.72,18.09 21.72,13.01 21.5,12.67 21.5,12.31 20.65,11.44 20.65,9.57 21.38,9.57 U4.26 | v24.62,19.46 25.88,18.7 25.88,18.82 IC2.4 26,18.82 28.38,18.82 IC2.5 | v19.38,20.57 13.12,20.57 11.88,21.82 11.88,23.07 5.62,23.07 R7.1
  Bottom 0.203: v24.62,19.46 24.38,19.36 23.72,18.7 21.88,18.7 v21.25,18.96 21.12,18.83 v19.38,20.57
D+  (via drill 0.39)
  Top 0.203: v22.12,1.95 22.12,1.82 21,1.82 20.5,2.33 20.5,5.58 21.38,5.58 U4.34 | v6.25,10.57 6.25,12.32 6,12.57 5.25,12.57 5.13,12.69 X3.D+
  Bottom 0.203: v22.12,1.95 21.88,1.7 9.62,1.7 5.62,5.7 5.62,6.95 5.75,6.95 6.37,7.57 6.37,10.57 v6.25,10.57
D-  (via drill 0.39)
  Top 0.203: v19.87,7.19 20.63,6.08 21.38,6.08 U4.33 | v6.5,13.07 6.12,13.07 6,13.2 5.25,13.2 5.11,13.34 X3.D-
  Bottom 0.203: v19.87,7.19 19.87,12.45 7.12,12.45 v6.5,13.07
DFU
  Top 0.203: 32.62,13.32 U1.24
EN  (via drill 0.39)
  Top 0.203: v26,15.95 26.4,15.95 28.07,15.04 28.12,14.81 28.11,14.57 R1.2 | v23.25,15.07 23,15.32 23,16.32 U2.3 | v61.38,18.82 62.63,17.57 S2.3
  Bottom 0.203: v26,15.95 25,15.07 v23.25,15.07 22.38,15.95 16.75,15.95 16.75,19.45 20,22.7 45.25,22.7 49.12,18.82 v61.38,18.82
FCTRYRST
  Top 0.203: 39.75,12.07 U1.34 39.8,9.25 38.48,7.93 38.48,6.15 39.37,5.26 PAD7.1
GND  (via drill 0.39)
  Top 0.203: U1.13 32.5,21.07 32.5,22.82 C5.2 32.5,22.95 44.62,22.95 44.62,21.7 U1.2 | U1.2 44.75,21.7 45.38,21.7 U1.1 45.5,21.7 v46.38,22.57 | 44.75,19.53 44.75,21.57 U1.2 | 44.75,19.53 44.75,14.57 45.25,14.07 45.25,12.2 45.38,12.07 U1.42 | 51.75,3.8 51.75,12.82 52.12,13.2 Q1.2 | 51.75,3.8 51.75,1.18 49.38,1.18 U41.2 | IC1.4 55.38,16.82 55.38,19.45 54.88,19.95 v54.88,20.32 54.88,21.32 54.25,21.95 IC1.6 54.25,22.07 54.88,22.7 54.88,23.2 55.12,23.45 58,23.45 58,23.07 D3.C 58.12,22.95 60.12,22.95 D2.C 60.25,22.95 61.12,22.07 61.12,19.82 60.5,19.2 60.5,18.45 | 63.75,15.95 63.89,16.08 S2.2 62.9,16.05 60.5,18.45 | 51.75,3.8 60.5,3.8 60.5,18.45 | U25.2 43.88,1.18 46.38,1.18 46.38,5.58 47.62,6.82 47.62,7.95 47.13,8.44 44.53,8.44 44.52,8.44 v44.07,8.06 | 31.25,18.95 32.5,18.95 U1.16 32.64,18.98 v34.42,18.98 | 31.25,18.95 30.38,18.95 C9.2 | 31.25,18.95 31.25,12.7 32.5,12.7 U1.25 32.62,12.57 33.62,11.57 33.62,10.95 35.49,8.44 35.56,8.38 v35.56,7.93 35.56,7.42 PAD10.1 30.48,2.34 PAD5.1 | IC2.2 26,21.32 26,20.2 IC2.3 25.88,20.2 23.62,20.2 | 23.62,20.2 23.62,20.82 C10.2 | 23.62,20.2 23.62,16.7 23.88,16.45 U2.2 24,16.32 24.12,16.2 24.12,15.7 25.12,14.7 25.5,14.7 25.5,12.57 25.56,12.51 | 24.62,5.08 24.62,6.95 24.88,7.2 U4.THERMAL | 24.62,5.08 24.62,3.83 U4.42 | 24.62,5.08 21.5,5.08 U4.35 | 24.62,5.08 U4.THERMAL | 25.12,6.58 24.88,6.58 U4.THERMAL | 25.12,6.58 28.25,6.58 U4.5 | 25.12,6.58 25.12,10.7 U4.18 25.12,10.82 25.12,11.45 25.38,11.7 25.38,12.32 25.56,12.51 | 25.12,6.58 U4.THERMAL | 25.56,12.51 26.37,13.07 R6.2 26.62,13.07 | 17.75,6.96 18.62,7.59 C2.2 | 17.75,6.96 17.25,6.58 C4.2
  Top 0.203: 17.75,6.96 17.75,9.2 17.25,9.95 C7.2 16.23,10.07 16.23,12.08 16.34,12.08 | 18.69,11.77 18.38,12.08 16.34,12.08 | 18.69,11.77 18.88,11.2 19,11.2 19.5,11.59 C1.2 | 14.38,11.7 14.38,12.2 C8.2 14.38,11.7 | 14.38,11.7 14.38,7.82 U3.2 14.25,7.7 14.25,3.45 13.62,2.83 R8.2 13.5,2.83 12,2.83 C14.2 11.88,2.83 10.62,4.08 10.62,6.08 11.5,6.95 SW1.4 11.5,7.07 11.25,7.32 11.25,11.45 C3.2 11.12,11.45 8.12,14.45 C6.2 8,14.57 8,15.82 7.89,15.93 v5.72,15.93 5.23,15.93 5.19,15.89 | 14.38,11.7 16,11.74 16.34,12.08 | SW1.2 7.5,7.07 5.38,9.2 5.38,9.32 4.52,9.32 X3.GND@P$6 4.35,11.17 X3.GND@P$5 2,11.39 X3.GND@P$8 2.29,12.68 X3.GND@P$9 1.91,14.48 3.24,15.51 3.24,16.81 3,17.07 | 3,17.07 1.62,18.45 L.C | 5.25,17.07 3,17.07 | 5.25,17.07 5.25,20.32 8.62,20.32 X1.1 | 23.62,20.2 21.25,20.2 20.74,19.58 20.32,19.11 18.75,17.54 18.75,11.96 18.69,11.77 | v42.55,19.11 43.29,19.11 43.71,19.53 44.29,19.53 44.3,19.53 44.75,19.53 | X3.GND@P$7 5.19,15.89 | 5.19,15.89 5.19,17.02 5.25,17.07
  Bottom 0.203: v54.88,20.32 48.62,20.32 v46.38,22.57 45.75,23.2 13.01,23.2 5.74,15.93 v5.72,15.93 | v35.56,7.93 35.56,8.06 35.81,8.19 41.02,8.19 v44.07,8.06 | 34.75,19.11 v42.55,19.11 | 34.75,19.11 34.67,19.11 | v34.42,18.98 34.62,18.98 34.75,19.11
MISO  (via drill 0.39)
  Top 0.203: v23.12,11.82 23.62,11.32 23.62,10.82 U4.21 | v46.25,12.32 46.75,12.82 v46.75,18.07 | v39.25,18.07 39.12,18.2 39.12,21.57 U1.5 | v27.25,19.57 27.25,20.07 28.38,20.07 IC2.6
  Bottom 0.203: v23.12,11.82 25.25,9.7 43.62,9.7 v46.25,12.32 | v46.75,18.07 v39.25,18.07 33.15,18.09 31.24,16.19 30.86,16.19 30.1,16.69 29.48,17.06 29.21,17.07 28.62,17.66 28.62,18.33 v27.25,19.57
MODE  (via drill 0.39)
  Top 0.203: v46,19.45 46,20.95 48.12,23.07 R4.1 | v44,18.82 43.25,18.07 43.25,13.57 42.62,12.95 42.62,12.07 U1.38
  Bottom 0.203: v46,19.45 45.38,18.82 v44,18.82
MOSI  (via drill 0.39)
  Top 0.203: v24.62,12.32 24.62,10.82 U4.19 | v22.25,19.45 v22.25,12.45 | v27.25,20.82 28.38,20.82 28.38,21.32 IC2.7 | v38.38,20.07 38.38,21.57 U1.6
  Bottom 0.203: v24.62,12.32 23.62,12.32 23.38,12.57 22.38,12.57 v22.25,12.45 | v22.25,19.45 23.62,20.82 v27.25,20.82 37.62,20.82 v38.38,20.07
N$1
  Top 0.203: R2.1 6.87,2.83 3.5,6.2 3.5,6.7 CHG.C
N$2
  Top 0.203: R7.2 5.5,21.32 3.75,19.57 3.75,18.57 L.A
N$3  (via drill 0.39)
  Top 0.203: v9.12,3.95 9.12,3.33 8.62,2.83 R2.2 | v15,6.45 15.25,6.7 15.25,7.7 U3.1
  Bottom 0.203: v9.12,3.95 10.75,5.58 14.12,5.58 v15,6.45
N$4
  Top 0.203: R8.1 15.25,2.83 15.25,5.08 U3.5
N$5  (via drill 0.39)
  Top 0.203: v28.38,3.7 28.38,4.45 U4.1 | 19.12,2.95 v18,2.95 | 19.12,2.95 19.12,2.7 X2.P$1 19.12,2.95 | 19.12,2.95 19.12,5.08 19.12,5.33 C2.1
  Bottom 0.203: v28.38,3.7 28.25,3.58 24.88,3.58 24.38,3.08 24.38,2.08 23,2.08 21.75,3.33 18.75,3.33 18.38,2.95 v18,2.95
N$6  (via drill 0.39)
  Top 0.203: v50.75,22.07 50.75,22.2 49.88,23.07 R4.2 | v59.12,21.95 60.12,20.95 D2.A
  Bottom 0.203: v50.75,22.07 50.88,21.95 v59.12,21.95
N$7  (via drill 0.39)
  Top 0.203: v29.38,4.83 29.38,5.08 28.38,5.08 U4.2 | 17.25,4.45 v18.25,4.45 | 17.25,4.45 17.25,4.7 C4.1 17.25,4.45 | 17.25,4.45 17.25,3.08 16.88,2.7 X2.P$2
  Bottom 0.203: v29.38,4.83 29,4.45 v18.25,4.45
N$8  (via drill 0.39)
  Top 0.203: v50.25,14.95 50.25,12.57 48.62,10.95 R10.2 | v57.25,16.57 58,17.32 58,20.82 D3.A
  Bottom 0.203: v50.25,14.95 51.88,16.57 v57.25,16.57
N$9
  Top 0.203: R9.2 55.5,13.32 54.12,13.32 Q1.1
N$10
  Top 0.203: Q1.3 53.12,10.95 54.12,9.95 54.12,7.2 LS1.2
SCK  (via drill 0.39)
  Top 0.203: v23.88,13.07 23.88,12.07 24.12,11.82 24.12,10.82 U4.20 | v18,13.2 18.25,13.45 18.25,17.82 v22.12,21.7 | v27.25,21.95 27.62,21.95 28.38,22.7 IC2.8 | v39.88,20.07 39.88,21.57 U1.4
  Bottom 0.203: v23.88,13.07 23.75,13.2 v18,13.2 | v22.12,21.7 22.38,21.95 v27.25,21.95 38,21.95 v39.88,20.07
SWCLK  (via drill 0.39)
  Top 0.203: U4.45 26.14,3.38 26.28,3.24 26.28,2.6 v26.67,2.09
  Bottom 0.203: v26.67,2.09 28.66,2.09 30.06,3.66 30.39,3.89 30.99,5.02 32.41,5.02 32.86,4.57 32.86,2.25 PAD4.1
SWDIO  (via drill 0.39)
  Top 0.203: U4.46 26.71,3.75 26.71,3.06 27.43,2.34 27.42,2.36 28.87,2.36 30.28,3.99 30.86,4.76 v31.37,5.82
  Bottom 0.203: PAD3.1 35.4,2.25 35.49,4.33 34.33,5.49 v31.37,5.82
VBAT  (via drill 0.39)
  Top 0.203: 12.19,12.51 11.25,13.45 C3.1 11.12,13.57 8.75,15.95 8.75,18.32 X1.2 | 12.19,12.51 12.25,12.45 12.25,8.95 13.38,7.82 U3.3 | v29.5,16.18 28.51,17.33 R3.1 | v17.5,16.7 16.5,15.7 16.5,13.82 D1.A 16.38,13.7 16.38,13.2 13.62,13.2 13.38,12.95 13.38,12.57 12.25,12.57 12.19,12.51 | v61.25,16.7 61.25,8.32 62.38,7.2 LS1.1
  Bottom 0.203: v17.5,16.7 28.75,16.7 v29.5,16.18 29.5,16.05 29.5,15.89 29.72,15.68 31.62,15.68 33.27,17.33 60.62,17.32 v61.25,16.7
VBUS  (via drill 0.39)
  Top 0.203: v13.12,6.33 13.12,5.45 13.38,5.2 U3.4 | v9.25,6.58 8.38,7.45 8.38,12.2 8.12,12.45 C6.1 8,12.57 6,14.57 v6.12,14.82 5.25,13.95 5.21,13.99 X3.VBUS | R1.1 26.23,14.57 25.75,15.07 24.88,15.95 24.88,16.32 U2.1 24.75,16.45 24.75,18.2 24.77,18.22 v24.5,18.34 | v19.73,17.45 20.75,15.2 | 20.75,15.2 20.75,14.32 20.25,13.82 D1.C | v19.5,15.2 20.75,15.2 | CHG.A 1.36,7.84 v1.4,8.06
  Bottom 0.203: v13.12,6.33 12.88,6.58 v9.25,6.58 | v19.73,17.45 20.49,18.21 21.72,18.09 24.38,18.34 v24.5,18.34 | v19.5,15.2 19.12,14.82 v6.12,14.82 3.28,11.97 3.28,8.54 2.79,8.06 v1.4,8.06
VDDCORE  (via drill 0.39)
  Top 0.203: v25.12,2.83 25.12,3.7 U4.43 | v16.98,11.2 18.12,11.34 18.12,10.08 18.49,9.71 C1.1
  Bottom 0.203: v25.12,2.83 25.25,2.95 28.62,2.95 30.12,4.45 30.12,5.58 18.48,5.58 18.16,5.9 18.12,8.57 v16.98,11.2
WIPER
  Top 0.203: R9.1 57.12,13.45 56.5,14.07 56.5,20.95 IC1.5

### Text on the board
tPlace: GND | #13 | VBAT | OFF | DFU | ON | v^SPEED | VARIO mini | RESET | G | C | D | R | V | -VOL | +VOL | SAM
bPlace: G | C | D | R | V | v^SPEED / VARIO / mini | SAM
tNames: SW1